# EasyEDA Pro project ProPrj_red-panda-afm_2025-05-21.epro, schematic Schematic4
Board Name: PiezoHolderXY; Create Date: 2024-12-16; Page Name: P1; Project Name: red-panda-afm; Schematic Name: Schematic4; Update Date: 2025-01-12; Company: 嘉立创EDA; Page Size: A4; Version: V1.0
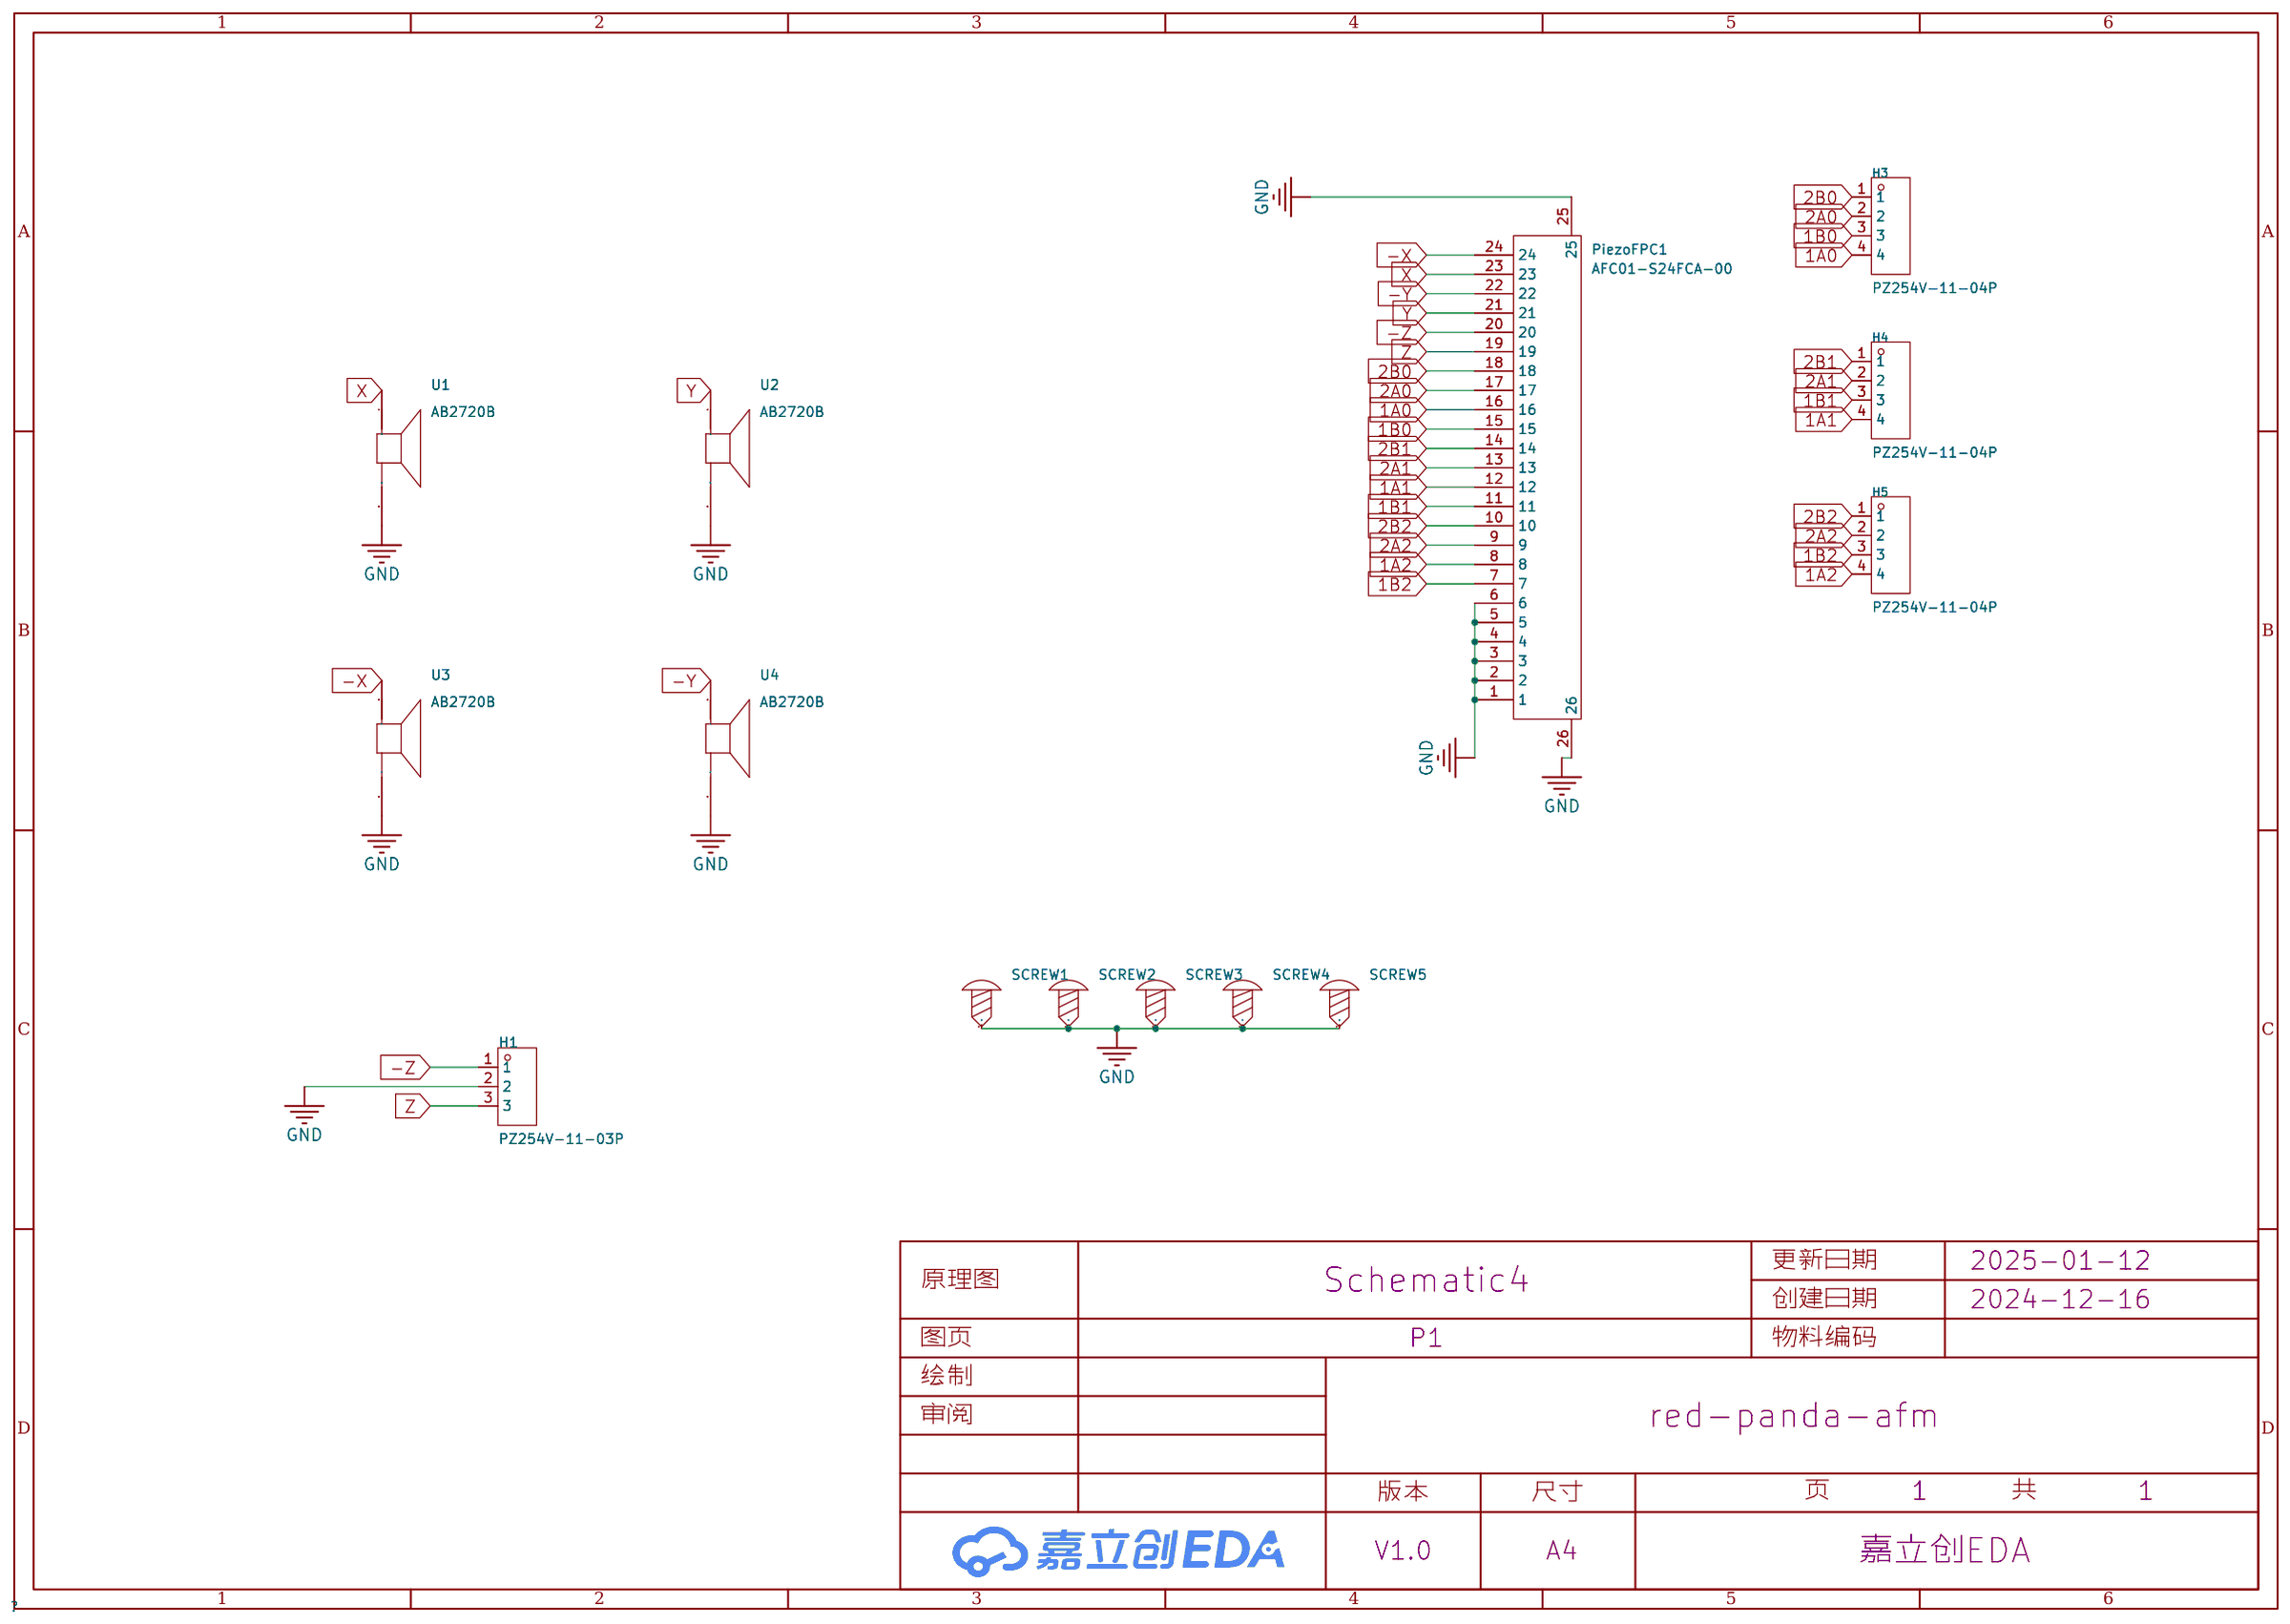
[diagram p2: schematic sheet]

## Parts
H1  PZ254V-11-03P  [HDR-TH_3P-P2.54-V-M]
H3  PZ254V-11-04P  [HDR-TH_4P-P2.54-V-M]
H4  PZ254V-11-04P  [HDR-TH_4P-P2.54-V-M]
H5  PZ254V-11-04P  [HDR-TH_4P-P2.54-V-M]
PiezoFPC1  AFC01-S24FCA-00  [FPC-SMD_P0.50-24P_FGS-XJ-H2.0]
SCREW1  -  [Screw-Hole-M2]
SCREW2  -  [Screw-Hole-M2]
SCREW3  -  [Screw-Hole-M2]
SCREW4  -  [Screw-Hole-M2]
SCREW5  -  [Screw-Hole-M2]
U1  AB2720B  [XDCR_AB2720B]
U2  AB2720B  [XDCR_AB2720B]
U3  AB2720B  [XDCR_AB2720B]
U4  AB2720B  [XDCR_AB2720B]

## Library data of the parts
H1 = PZ254V-11-03P: Pin Structure:1x3P Pitch:2.54mm Row Spacing:- Circluar Pins/Square Pins:Square Pins Mounting Type:Straight Number of Rows:Plugin Number of Pins:3P Current Rating (Max):3A Voltage Rating (Max):250V Length of Mating Pin:6mm Insulation Height:2.5mm Length of; LCSC Part Name: 间距:2.54mm 1x3P 直插 方针; Supplier Part: C2937625; Manufacturer: XFCN(兴飞); Supplier Footprint: 插件,P=2.54mm; JLCPCB Part Class: Extended Part; Datasheet: https://atta.szlcsc.com/upload/public/pdf/source/20200309/C492402_8335C3D49C4E4C618838D59BB1D024C1.pdf; Supplier: LCSC; Pin Structure: 1x3P; Pitch: 2.54mm; Circluar Pins/Square Pins: Square Pins; Mounting Type: Straight; Number of Rows: Plugin; Number of Pins: 3P; Current Rating (Max): 3A; Voltage Rating (Max): 250V; Length of Mating Pin: 6mm; Insulation Height: 2.5mm; Length of End Connection Pin: 3mm; Operating Temperature Range: -40℃~+105℃; Color: Black
H3-H5 = PZ254V-11-04P: Pin Structure:1x4P Pitch:2.54mm Row Spacing:- Circluar Pins/Square Pins:Square Pins Mounting Type:Straight Number of Rows:Plugin Number of Pins:4P Current Rating (Max):3A Voltage Rating (Max):250V Length of Mating Pin:6mm Insulation Height:2.5mm Length of; LCSC Part Name: 间距:2.54mm 1x4P 直插 方针; Supplier Part: C2691448; Manufacturer: XFCN(兴飞); Supplier Footprint: 插件,P=2.54mm; JLCPCB Part Class: Extended Part; Datasheet: https://atta.szlcsc.com/upload/public/pdf/source/20200309/C492403_F9F19131791D08044AD4F84F8E751A34.pdf; Supplier: LCSC; Pin Structure: 1x4P; Pitch: 2.54mm; Circluar Pins/Square Pins: Square Pins; Mounting Type: Straight; Number of Rows: Plugin; Number of Pins: 4P; Current Rating (Max): 3A; Voltage Rating (Max): 250V; Length of Mating Pin: 6mm; Insulation Height: 2.5mm; Length of End Connection Pin: 3mm; Operating Temperature Range: -40℃~+105℃; Color: Black
PiezoFPC1 = AFC01-S24FCA-00: 锁定特性:翻盖式;触点类型:下接;触点数量:24P;间距:0.5mm;安装类型:卧贴;; LCSC Part Name: 间距:0.5mm P数:24P 翻盖式 下接; Supplier Part: C262669; Manufacturer: JS(钜硕电子); Supplier Footprint: SMD,P=0.5mm,卧贴; JLCPCB Part Class: Extended Part; Datasheet: https://atta.szlcsc.com/upload/public/pdf/source/20190816/C413942_2A72D1AC756EAE17EEDF756A339D4500.pdf; Supplier: LCSC; Locking Feature: 翻盖式; Contact Type: 下接; Number of Contacts: 24P; Pitch: 0.5mm; Mounting Type: 卧贴; FFC, FCB Thickness: 0.3mm; Height Above Board: 2mm
SCREW1-SCREW5 = Screw-Hole-M2: Supplier Footprint: 插件
U1-U4 = AB2720B

## Nets
GND: H1.2 PiezoFPC1.1 PiezoFPC1.2 PiezoFPC1.3 PiezoFPC1.4 PiezoFPC1.5 PiezoFPC1.6 PiezoFPC1.25 PiezoFPC1.26 SCREW1.1 SCREW2.1 SCREW3.1 SCREW4.1 SCREW5.1 U1.2 U2.2 U3.2 U4.2
1A0: H3.4 PiezoFPC1.16
1A1: H4.4 PiezoFPC1.12
1A2: H5.4 PiezoFPC1.8
1B0: H3.3 PiezoFPC1.15
1B1: H4.3 PiezoFPC1.11
1B2: H5.3 PiezoFPC1.7
2A0: H3.2 PiezoFPC1.17
2A1: H4.2 PiezoFPC1.13
2A2: H5.2 PiezoFPC1.9
2B0: H3.1 PiezoFPC1.18
2B1: H4.1 PiezoFPC1.14
2B2: H5.1 PiezoFPC1.10
-X: PiezoFPC1.24 U3.1
-Y: PiezoFPC1.22 U4.1
-Z: H1.1 PiezoFPC1.20
X: PiezoFPC1.23 U1.1
Y: PiezoFPC1.21 U2.1
Z: H1.3 PiezoFPC1.19
